# Altium schematic sheet PDM-S01-V00-SenseLineControl.SchDoc: ####
size A3; DrawnBy: QUT Motorsport Umpa Lumpas; Organization: QUT Motorsport; Address1: O-120, Gardens Point; Address2: 2 George Street; Address3: Brisbane, QLD 4000; Address4: Australia; DocumentNumber: ####; Revision: 00; SheetNumber: 1; SheetTotal: 1; Version: 00; Project: ####; PageSetup: Record=PageOptions|CenterHorizontal=True|CenterVertical=True|PrintScale=0.97|XCorrection=1.00|YCorrection=1.00|PrintKind=0|BorderSize=5000000|LeftOffset=0|BottomOffset=0|Orientation=2|PaperLength=1000|PaperWidth=1000|Scale=100|PaperSource=7|PrintQuality=-4|MediaType=1|DitherType=10|PaperKind=A4|PrintScaleMode=1
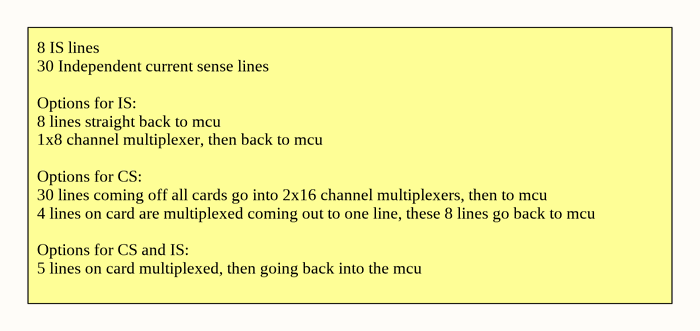
[diagram p0: PDM-S01-V00-SenseLineControl.SchDoc]

## Notes on the sheet
- 8 IS lines
  30 Independent current sense lines
  Options for IS:
  8 lines straight back to mcu
  1x8 channel multiplexer, then back to mcu
  Options for CS:
  30 lines coming off all cards go into 2x16 channel multiplexers, then to mcu
  4 lines on card are multiplexed coming out to one line, these 8 lines go back to mcu
  Options for CS and IS:
  5 lines on card multiplexed, then going back into the mcu
- Revision History:
- Sheet Title:
- Rev
- Date
- Description
- Project:
- Size:
- Drawn By:
- A3
- Number:
- Revision:
- Sheet
- Version:
- of
- QUT Motorsport
- O-120, Gardens Point
- 2 George Street
- Brisbane, QLD 4000
- Australia
- Print Date:
- Print Time:
- File Name: